# Altium schematic sheet MCU.SchDoc
size A3; SheetNumber: 1; SheetTotal: 3
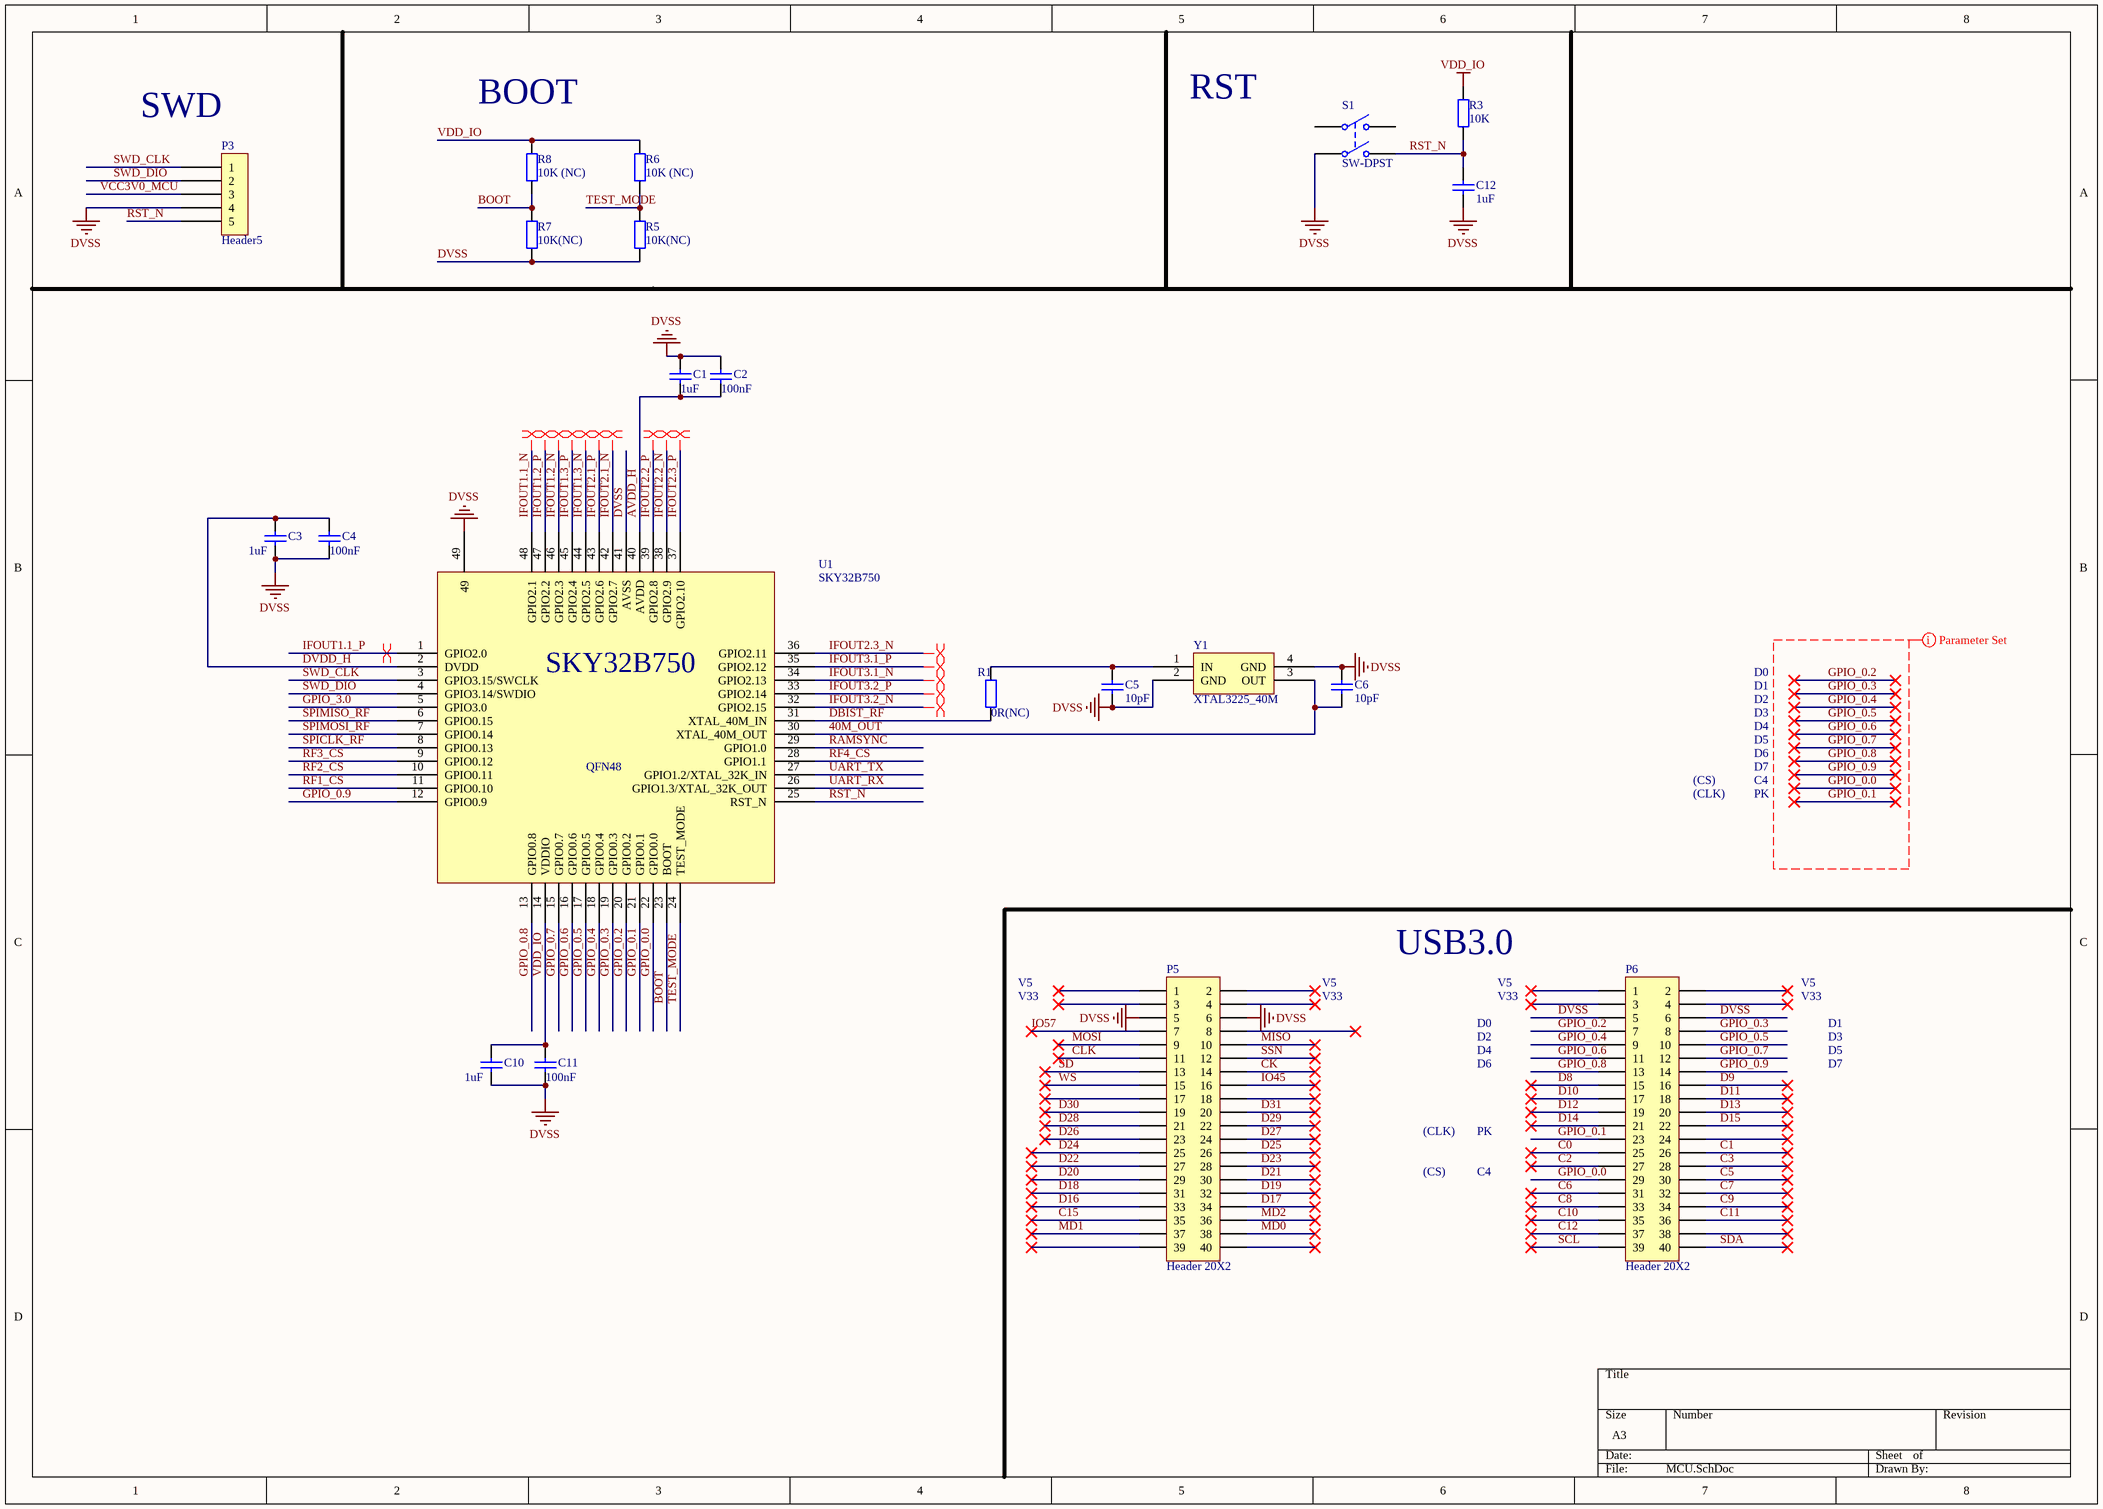
[diagram p0: MCU.SchDoc]

## Parts
C1  1uF  [R0603]
C2  100nF  [R0603]
C3  1uF  [R0603]
C4  100nF  [R0603]
C5  10pF  [R0603]
C6  10pF  [R0603]
C10  1uF  [R0603]
C11  100nF  [R0603]
C12  1uF  [R0603]
P3  Header5  [HDR1X5]
P5  Header 20X2  [2X20_2_54_SMD]
P6  Header 20X2  [2X20_2_54_SMD]
R1  0R(NC)  [R0603]
R3  10K  [R0603]
R5  10K(NC)  [R0603]
R6  10K (NC)  [R0603]
R7  10K(NC)  [R0603]
R8  10K (NC)  [R0603]
S1  SW-DPST  [sw]
U1  SKY32B750  [QFN48]
Y1  XTAL3225_40M  [XTAL-3225]

## Nets
DVSS: C1.2 C2.2 C3.1 C4.1 C5.2 C6.1 C10.1 C11.1 C12.1 P3.4 P5.5 P5.6 P6.5 P6.6 R5.2 R7.2 S1.3(COMMON2) U1.41(AVSS) U1.49 Y1.2(GND) Y1.4(GND)
VDD_IO: C10.2 C11.2 R3.2 R6.1 R8.1 U1.14(VDDIO)
40M_OUT: C6.2 U1.30(XTAL_40M_OUT) Y1.3(OUT)
AVDD_H: C1.1 C2.1 U1.40(AVDD)
BOOT: R7.1 R8.2 U1.23(BOOT)
C0: P6.25
C1: P6.26
C2: P6.27
C3: P6.28
C5: P6.30
C6: P6.31
C7: P6.32
C8: P6.33
C9: P6.34
C10: P6.35
C11: P6.36
C12: P6.37
C15: P5.35
CK: P5.14
CLK: P5.11
D8: P6.15
D9: P6.16
D10: P6.17
D11: P6.18
D12: P6.19
D13: P6.20
D14: P6.21
D15: P6.22
D16: P5.33
D17: P5.34
D18: P5.31
D19: P5.32
D20: P5.29
D21: P5.30
D22: P5.27
D23: P5.28
D24: P5.25
D25: P5.26
D26: P5.23
D27: P5.24
D28: P5.21
D29: P5.22
D30: P5.19
D31: P5.20
DBIST_RF: R1.1 U1.31(XTAL_40M_IN)
DVDD_H: C3.2 C4.2 U1.2(DVDD)
GPIO_0.0: P6.29 U1.22(GPIO0.0)
GPIO_0.1: P6.23 U1.21(GPIO0.1)
GPIO_0.2: P6.7 U1.20(GPIO0.2)
GPIO_0.3: P6.8 U1.19(GPIO0.3)
GPIO_0.4: P6.9 U1.18(GPIO0.4)
GPIO_0.5: P6.10 U1.17(GPIO0.5)
GPIO_0.6: P6.11 U1.16(GPIO0.6)
GPIO_0.7: P6.12 U1.15(GPIO0.7)
GPIO_0.8: P6.13 U1.13(GPIO0.8)
GPIO_0.9: P6.14 U1.12(GPIO0.9)
GPIO_3.0: U1.5(GPIO3.0)
IFOUT1.1_N: U1.48(GPIO2.1)
IFOUT1.1_P: U1.1(GPIO2.0)
IFOUT1.2_N: U1.46(GPIO2.3)
IFOUT1.2_P: U1.47(GPIO2.2)
IFOUT1.3_N: U1.44(GPIO2.5)
IFOUT1.3_P: U1.45(GPIO2.4)
IFOUT2.1_N: U1.42(GPIO2.7)
IFOUT2.1_P: U1.43(GPIO2.6)
IFOUT2.2_N: U1.38(GPIO2.9)
IFOUT2.2_P: U1.39(GPIO2.8)
IFOUT2.3_N: U1.36(GPIO2.11)
IFOUT2.3_P: U1.37(GPIO2.10)
IFOUT3.1_N: U1.34(GPIO2.13)
IFOUT3.1_P: U1.35(GPIO2.12)
IFOUT3.2_N: U1.32(GPIO2.15)
IFOUT3.2_P: U1.33(GPIO2.14)
IO45: P5.16
IO57: P5.7
MD0: P5.38
MD1: P5.37
MD2: P5.36
MISO: P5.10
MOSI: P5.9
RAMSYNC: U1.29(GPIO1.0)
RF1_CS: U1.11(GPIO0.10)
RF2_CS: U1.10(GPIO0.11)
RF3_CS: U1.9(GPIO0.12)
RF4_CS: U1.28(GPIO1.1)
RST_N: C12.2 P3.5 R3.1 S1.4(NO2) U1.25(RST_N)
SCL: P6.39
SD: P5.13
SDA: P6.40
SPICLK_RF: U1.8(GPIO0.13)
SPIMISO_RF: U1.6(GPIO0.15)
SPIMOSI_RF: U1.7(GPIO0.14)
SSN: P5.12
SWD_CLK: P3.1 U1.3(GPIO3.15/SWCLK)
SWD_DIO: P3.2 U1.4(GPIO3.14/SWDIO)
TEST_MODE: R5.1 R6.2 U1.24(TEST_MODE)
UART_RX: U1.26(GPIO1.3/XTAL_32K_OUT)
UART_TX: U1.27(GPIO1.2/XTAL_32K_IN)
VCC3V0_MCU: P3.3
WS: P5.15
NetC5_1: C5.1 R1.2 Y1.1(IN)

Not connected (* = marked no-connect by the designer): P5 1* 2* 3* 4* 8* 17* 18* 39* 40*; P6 1* 2* 3* 4* 24* 38*; S1 1(COMMON1) 2(NO1)

## Layout directives
differential pair: IFOUT1.1_N, IFOUT1.1_P, IFOUT1.2_N, IFOUT1.2_P, IFOUT1.3_N, IFOUT1.3_P, IFOUT2.1_N, IFOUT2.1_P, IFOUT2.2_N, IFOUT2.2_P, IFOUT2.3_N, IFOUT2.3_P, IFOUT3.1_N, IFOUT3.1_P, IFOUT3.2_N, IFOUT3.2_P
net class OSPI: GPIO_0.0, GPIO_0.1, GPIO_0.2, GPIO_0.3, GPIO_0.4, GPIO_0.5, GPIO_0.6, GPIO_0.7, GPIO_0.8, GPIO_0.9

## Notes on the sheet
- (near R8) BOOT
- RST
- (near P3) SWD
- D0
- D1
- D2
- D3
- (CS)
- D4
- D5
- D6
- D7
- C4
- (CLK)
- PK
- V5
- USB3.0
- V33
- (in symbol SYK32B750) QFN48

## Library data of the parts
C1-C4 C10 C11 = Cap: CAP, CERM, 4.7nF, 100 V, +/- 5%, X7R, 0603; Value: 100pF; Published: 8-Jun-2000; LatestRevisionDate: 17-Jul-2002; LatestRevisionNote: Re-released for DXP Platform.; PackageReference: RAD-0.3; Publisher: Altium Limited
C5 C6 C12 = Cap: Capacitor; Published: 8-Jun-2000; LatestRevisionDate: 17-Jul-2002; LatestRevisionNote: Re-released for DXP Platform.; PackageReference: RAD-0.3; Publisher: Altium Limited; PackageDescription: Radial Cap, Thru-Hole; 2 Leads; 0.3 in Pin Spacing
  C5 C6: Value: 10pF
  C12: Value: 1uF
P5 P6 = Header 20X2: Header, 20-Pin, Dual row; LatestRevisionDate: 17-Jul-2002; LatestRevisionNote: Re-released for DXP Platform.; Publisher: Altium Limited
R1 R3 = Res2: Resistor; Published: 8-Jun-2000; LatestRevisionDate: 17-Jul-2002; LatestRevisionNote: Re-released for DXP Platform.; PackageReference: AXIAL-0.4; Publisher: Altium Limited; PackageDescription: Axial Device, Thru-Hole; 2 Leads; 0.4 in Pin Spacing
  R1: Value: 0R
  R3: Value: 10K
R5-R8 = Res2: Resistor; Value: 0R; Published: 8-Jun-2000; LatestRevisionDate: 17-Jul-2002; LatestRevisionNote: Re-released for DXP Platform.; PackageReference: AXIAL-0.4; Publisher: Altium Limited; PackageDescription: Axial Device, Thru-Hole; 2 Leads; 0.4 in Pin Spacing
S1 = SW-DPST: Double-Pole, Single-Throw Switch; Published: 24-Mar-1999; LatestRevisionDate: 17-Jul-2002; LatestRevisionNote: Re-released for DXP Platform.; PackageReference: DPST-4; Publisher: Altium Limited; PackageDescription: Switch; 4 Leads
U1 = SYK32B750
Y1 = XTAL3225